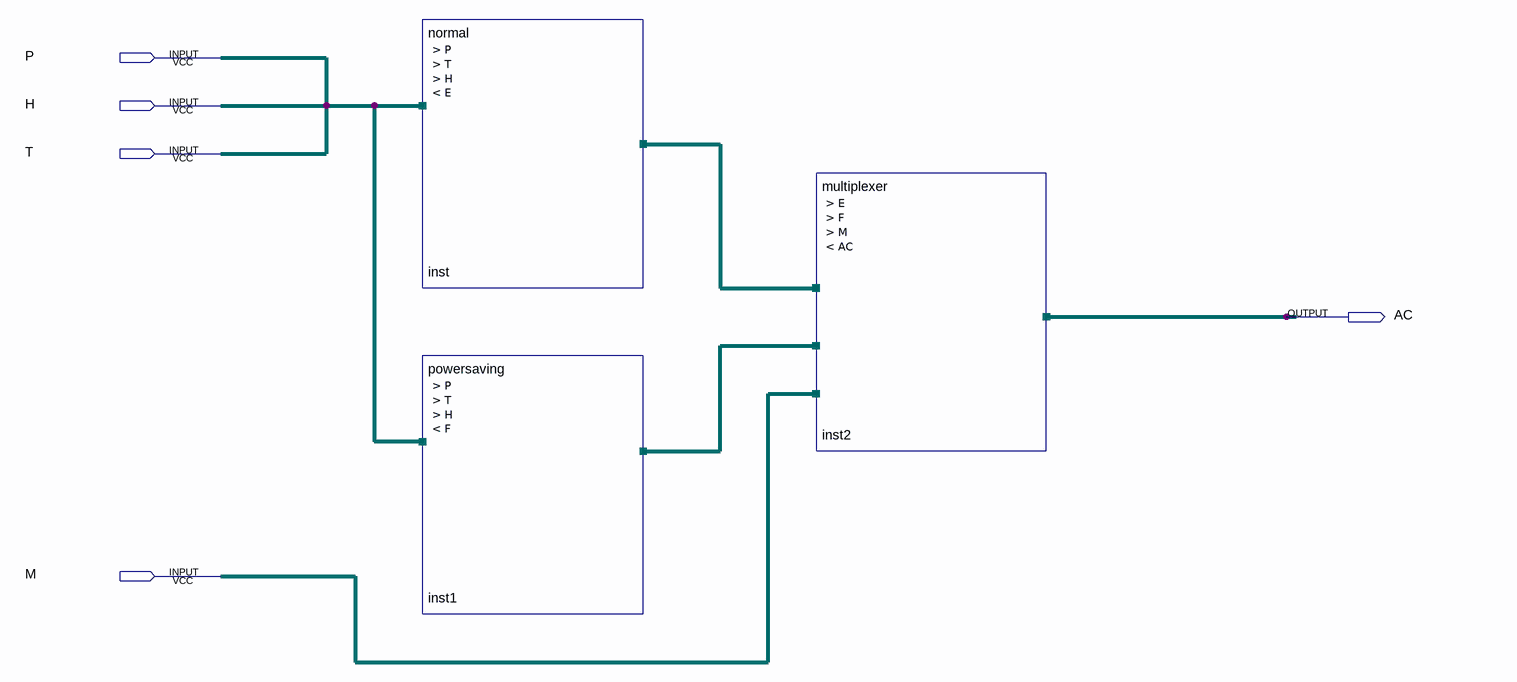
[diagram p0: schematic sheet]
// Quartus schematic lab4step2.bdf as structural Verilog: 3 symbols, 5 pins
module lab4step2 (
  input  P,
  input  H,
  input  T,
  input  M,
  output AC
);

  wire E, F;

  normal inst (.P(P), .T(T), .H(H), .E(E));
  powersaving inst1 (.P(P), .T(T), .H(H), .F(F));
  multiplexer inst2 (.E(E), .F(F), .M(M), .AC(AC));
endmodule
